# Altium schematic sheet MCU.SchDoc: AVR processor
size A3; Author: Grzegorz Gajoch; DocumentNumber: 9; SheetNumber: 9; SheetTotal: 16; Model: EM1; PageSetup: Record=PageOptions|CenterHorizontal=True|CenterVertical=True|PrintScale=0.52|XCorrection=1.00|YCorrection=1.00|PrintKind=1|BorderSize=5000000|LeftOffset=0|BottomOffset=0|Orientation=2|PaperLength=4200|PaperWidth=2970|Scale=100|PaperSource=7|PrintQuality=600|MediaType=1|DitherType=10|PaperKind=A3|PrintScaleMode=1
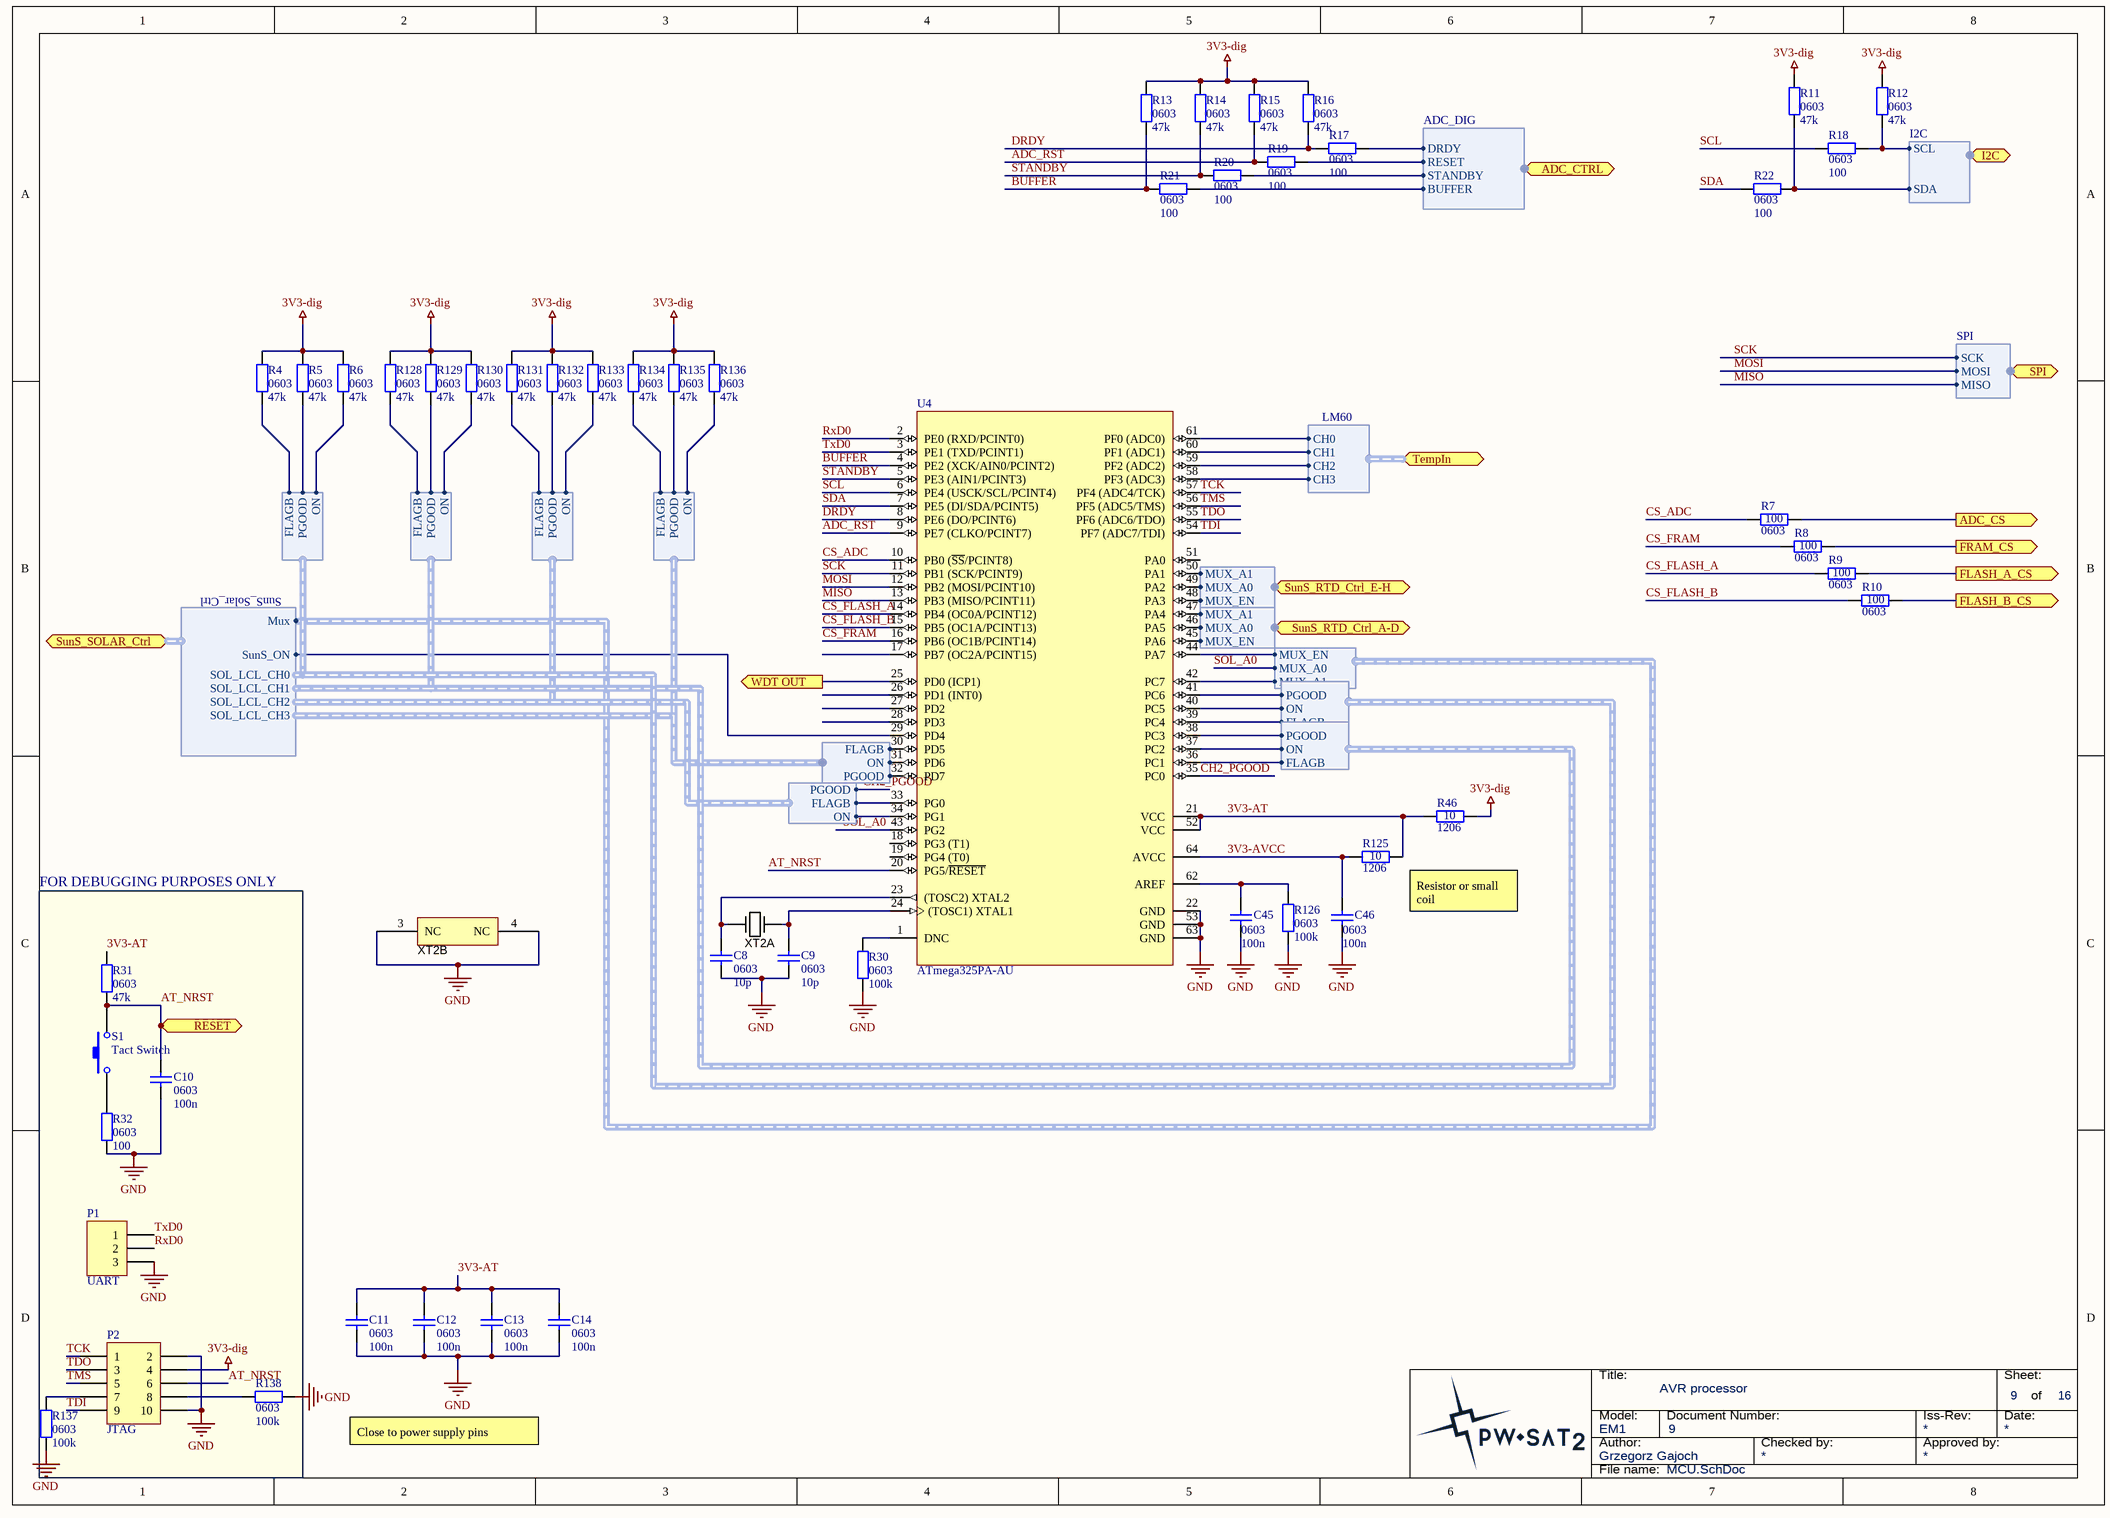
[diagram p0: MCU.SchDoc]

## Parts
C8  0603  value 10p  [SMD_Capacitor_0603]
C9  0603  value 10p  [SMD_Capacitor_0603]
C10  0603  value 100n  [SMD_Capacitor_0603]
C11  0603  value 100n  [SMD_Capacitor_0603]
C12  0603  value 100n  [SMD_Capacitor_0603]
C13  0603  value 100n  [SMD_Capacitor_0603]
C14  0603  value 100n  [SMD_Capacitor_0603]
C45  0603  value 100n  [SMD_Capacitor_0603]
C46  0603  value 100n  [SMD_Capacitor_0603]
P1  UART  [HDR1X3]
P2  JTAG  [HDR2X5]
R4  0603  value 47k  [SMD_Resistor_0603]
R5  0603  value 47k  [SMD_Resistor_0603]
R6  0603  value 47k  [SMD_Resistor_0603]
R7  0603  value 100  [SMD_Resistor_0603]
R8  0603  value 100  [SMD_Resistor_0603]
R9  0603  value 100  [SMD_Resistor_0603]
R10  0603  value 100  [SMD_Resistor_0603]
R11  0603  value 47k  [SMD_Resistor_0603]
R12  0603  value 47k  [SMD_Resistor_0603]
R13  0603  value 47k  [SMD_Resistor_0603]
R14  0603  value 47k  [SMD_Resistor_0603]
R15  0603  value 47k  [SMD_Resistor_0603]
R16  0603  value 47k  [SMD_Resistor_0603]
R17  0603  value 100  [SMD_Resistor_0603]
R18  0603  value 100  [SMD_Resistor_0603]
R19  0603  value 100  [SMD_Resistor_0603]
R20  0603  value 100  [SMD_Resistor_0603]
R21  0603  value 100  [SMD_Resistor_0603]
R22  0603  value 100  [SMD_Resistor_0603]
R30  0603  value 100k  [SMD_Resistor_0603]
R31  0603  value 47k  [SMD_Resistor_0603]
R32  0603  value 100  [SMD_Resistor_0603]
R46  1206  value 10  [SMD_Resistor_1206]
R125  1206  value 10  [SMD_Resistor_1206]
R126  0603  value 100k  [SMD_Resistor_0603]
R128  0603  value 47k  [SMD_Resistor_0603]
R129  0603  value 47k  [SMD_Resistor_0603]
R130  0603  value 47k  [SMD_Resistor_0603]
R131  0603  value 47k  [SMD_Resistor_0603]
R132  0603  value 47k  [SMD_Resistor_0603]
R133  0603  value 47k  [SMD_Resistor_0603]
R134  0603  value 47k  [SMD_Resistor_0603]
R135  0603  value 47k  [SMD_Resistor_0603]
R136  0603  value 47k  [SMD_Resistor_0603]
R137  0603  value 100k  [SMD_Resistor_0603]
R138  0603  value 100k  [SMD_Resistor_0603]
S1  Tact Switch  [Tact Switch 3x6]
U4  ATmega325PA-AU  [64A_N]
XT2  (no value)  [SMD, 5mm x 3.2mm]  (parts A,B of 2)

## Blocks framed on the sheet
FOR DEBUGGING PURPOSES ONLY: C10 P1 P2 R31 R32 R137 R138 S1

## Ports
ADC_CS (out), ADC_CTRL (harness ADC_DIG), FLASH_A_CS (out), FLASH_B_CS (out), FRAM_CS (out), I2C (harness I2C), RESET (in), SPI (harness SPI), SunS_RTD_Ctrl_A-D (harness MUX_Control), SunS_RTD_Ctrl_E-H (harness MUX_Control), SunS_SOLAR_Ctrl (harness SunS_Solar_Ctrl), TempIn (harness LM60), WDT OUT (out)

## Harnesses
MUX_Control: MUX_A0, MUX_A1, MUX_EN
I2C: SCL, SDA
SPI: MOSI, MISO, SCK
ADC_DIG: DRDY, RESET, STANDBY, BUFFER
SunS_Solar_Ctrl: Mux, SunS_ON, SOL_LCL_CH0, SOL_LCL_CH1, SOL_LCL_CH2, SOL_LCL_CH3
LCL_StatCtrl: FLAGB, PGOOD, ON
LM60: CH0, CH1, CH2, CH3

## Nets
3V3-dig: P2.4 R4.2 R5.2 R6.2 R11.2 R12.2 R13.2 R14.2 R15.2 R16.2 R46.1 R128.2 R129.2 R130.2 R131.2 R132.2 R133.2 R134.2 R135.2 R136.2
GND: C8.1 C9.1 C10.1 C11.1 C12.1 C13.1 C14.1 C45.1 C46.1 P1.3 P2.2 P2.10 R30.1 R32.2 R126.1 R137.1 R138.1 U4.22(GND) U4.53(GND) U4.63(GND) XT2.3(NC) XT2.4(NC)
3V3-AT: C11.2 C12.2 C13.2 C14.2 R31.2 R46.2 R125.2 U4.21(VCC) U4.52(VCC)
3V3-AVCC: C46.2 R125.1 U4.64(AVCC)
ADC_CS: R7.1 ; port ADC_CS
ADC_RST: R15.1 R19.1 U4.9(PE7_(CLKO/PCINT7))
AT_NRST: C10.2 P2.6 R31.1 S1.2 U4.20(PG5/~{RESET}) ; port RESET
BUFFER: R13.1 R21.1 U4.4(PE2_(XCK/AIN0/PCINT2))
CH2_PGOOD: R132.1 U4.35(PC0) ; harness LCL_StatCtrl.PGOOD
CS_ADC: R7.2 U4.10(PB0_(~{SS}/PCINT8))
CS_FLASH_A: R9.2 U4.14(PB4_(OC0A/PCINT12))
CS_FLASH_B: R10.2 U4.15(PB5_(OC1A/PCINT13))
CS_FRAM: R8.2 U4.16(PB6_(OC1B/PCINT14))
DRDY: R16.1 R17.1 U4.8(PE6_(DO/PCINT6))
FLASH_A_CS: R9.1 ; port FLASH_A_CS
FLASH_B_CS: R10.1 ; port FLASH_B_CS
FRAM_CS: R8.1 ; port FRAM_CS
MISO: U4.13(PB3_(MISO/PCINT11)) ; port SPI.MISO
MOSI: U4.12(PB2_(MOSI/PCINT10)) ; port SPI.MOSI
RxD0: P1.2 U4.2(PE0_(RXD/PCINT0))
SCK: U4.11(PB1_(SCK/PCINT9)) ; port SPI.SCK
SCL: R18.1 U4.6(PE4_(USCK/SCL/PCINT4))
SDA: R22.1 U4.7(PE5_(DI/SDA/PCINT5))
SOL_A0: U4.43(PG2) ; harness MUX_Control.MUX_A0
STANDBY: R14.1 R20.1 U4.5(PE3_(AIN1/PCINT3))
TCK: P2.1 U4.57(PF4_(ADC4/TCK))
TDI: P2.9 U4.54(PF7_(ADC7/TDI))
TDO: P2.3 U4.55(PF6_(ADC6/TDO))
TMS: P2.5 U4.56(PF5_(ADC5/TMS))
TxD0: P1.1 U4.3(PE1_(TXD/PCINT1))
WDT OUT: U4.25(PD0_(ICP1)) ; port WDT OUT
NetC8_2: C8.2 U4.23((TOSC2)_XTAL2) XT2.1(IN)
NetC9_2: C9.2 U4.24((TOSC1)_XTAL1) XT2.2(OUT)
NetC45_2: C45.2 R126.2 U4.62(AREF)
NetP2_7: P2.7 R137.2
NetP2_8: P2.8 R138.2
NetR4_1: R4.1 U4.39(PC4) ; harness LCL_StatCtrl.FLAGB
NetR5_1: R5.1 U4.41(PC6) ; harness LCL_StatCtrl.PGOOD
NetR6_1: R6.1 U4.40(PC5) ; harness LCL_StatCtrl.ON
NetR11_1: R11.1 R22.2 ; port I2C.SDA
NetR12_1: R12.1 R18.2 ; port I2C.SCL
NetR17_2: R17.2 ; port ADC_CTRL.DRDY
NetR19_2: R19.2 ; port ADC_CTRL.RESET
NetR20_2: R20.2 ; port ADC_CTRL.STANDBY
NetR21_2: R21.2 ; port ADC_CTRL.BUFFER
NetR30_2: R30.2 U4.1(DNC)
NetR32_1: R32.1 S1.1
NetR128_1: R128.1 U4.36(PC1) ; harness LCL_StatCtrl.FLAGB
NetR129_1: R129.1 U4.38(PC3) ; harness LCL_StatCtrl.PGOOD
NetR130_1: R130.1 U4.37(PC2) ; harness LCL_StatCtrl.ON
NetR131_1: R131.1 U4.33(PG0) ; harness LCL_StatCtrl.FLAGB
NetR133_1: R133.1 U4.34(PG1) ; harness LCL_StatCtrl.ON
NetR134_1: R134.1 U4.30(PD5) ; harness LCL_StatCtrl.FLAGB
NetR135_1: R135.1 U4.32(PD7) ; harness LCL_StatCtrl.PGOOD
NetR136_1: R136.1 U4.31(PD6) ; harness LCL_StatCtrl.ON
NetU4_29: U4.29(PD4) ; port SunS_SOLAR_Ctrl.SunS_ON
NetU4_42: U4.42(PC7) ; harness MUX_Control.MUX_A1
NetU4_44: U4.44(PA7) ; harness MUX_Control.MUX_EN
NetU4_45: U4.45(PA6) ; port SunS_RTD_Ctrl_A-D.MUX_EN
NetU4_46: U4.46(PA5) ; port SunS_RTD_Ctrl_A-D.MUX_A0
NetU4_47: U4.47(PA4) ; port SunS_RTD_Ctrl_A-D.MUX_A1
NetU4_48: U4.48(PA3) ; port SunS_RTD_Ctrl_E-H.MUX_EN
NetU4_49: U4.49(PA2) ; port SunS_RTD_Ctrl_E-H.MUX_A0
NetU4_50: U4.50(PA1) ; port SunS_RTD_Ctrl_E-H.MUX_A1
NetU4_58: U4.58(PF3_(ADC3)) ; port TempIn.CH3
NetU4_59: U4.59(PF2_(ADC2)) ; port TempIn.CH2
NetU4_60: U4.60(PF1_(ADC1)) ; port TempIn.CH1
NetU4_61: U4.61(PF0_(ADC0)) ; port TempIn.CH0

Not connected (* = marked no-connect by the designer): U4 17(PB7_(OC2A/PCINT15)) 18(PG3_(T1)) 19(PG4_(T0)) 26(PD1_(INT0)) 27(PD2) 28(PD3) 51(PA0)

## Notes on the sheet
- (near R125) Resistor or small coil
- Close to power supply pins
- Title:
- Sheet:
- of
- Author:
- Model:
- Document Number:
- Checked by:
- Iss-Rev:
- Approved by:
- Date:
- File name:

## Library data of the parts
C8 C9 = Cap1: Capacitor; Published: 8-Jun-2000; LatestRevisionDate: 17-Jul-2002; LatestRevisionNote: Re-released for DXP Platform.; PackageReference: RAD-0.3; Publisher: Altium Limited; PackageDescription: Radial Cap, Thru-Hole; 2 Leads; 0.3 in Pin Spacing
C10-C14 C45 C46 = Cap: Capacitor; Published: 8-Jun-2000; LatestRevisionDate: 17-Jul-2002; LatestRevisionNote: Re-released for DXP Platform.; PackageReference: RAD-0.3; Publisher: Altium Limited; PackageDescription: Radial Cap, Thru-Hole; 2 Leads; 0.3 in Pin Spacing
P1 = Header 3: Header, 3-Pin; LatestRevisionDate: 17-Jul-2002; LatestRevisionNote: Re-released for DXP Platform.; Publisher: Altium Limited
P2 = Header 5X2: Header, 5-Pin, Dual row; LatestRevisionDate: 17-Jul-2002; LatestRevisionNote: Re-released for DXP Platform.; Publisher: Altium Limited
R4-R22 R30-R32 R46 R125 R126 R128-R138 = Res2: Resistor; Published: 8-Jun-2000; LatestRevisionDate: 17-Jul-2002; LatestRevisionNote: Re-released for DXP Platform.; PackageReference: AXIAL-0.4; Publisher: Altium Limited; PackageDescription: Axial Device, Thru-Hole; 2 Leads; 0.4 in Pin Spacing
S1 = TactSwitch: Supplier 1: Farnell
U4 = ATmega325PA-AU: 8-bit AVR Microcontroller, 1.5-5.5V, 32KB Flash, 1KB EEPROM, 2KB SRAM, 64-pin TQFP, Industrial Grade (-40°C to 85°C); DatasheetVersion: revD, Jun-2011; PackageVersion: revC, Oct-2010; PackageReference: 64A; PackageDescription: 64-Pin Plastic Thin Profile Quad Flat Pack, 14 x 14 x 1.0 mm Body, 0.8 mm Pitch (TQFP); Code_JEDEC: MS-026-AEB; ComponentLink1Description: Manufacturer URL; ComponentLink1URL: http://www.atmel.com/; ComponentLink2Description: ATmega165A/PA/325A/PA/3250A/PA/645A/P/6450A/P Datasheet; ComponentLink2URL: http://www.atmel.com/dyn/resources/prod_documents/doc8285.pdf; ComponentLink3Description: ATmega165A/PA/325A/PA/3250A/PA/645A/P/6450A/P Summary; ComponentLink3URL: http://www.atmel.com/dyn/resources/prod_documents/8285S.pdf
XT2 = Crystal_SMD: Resonator Ceramic; Manufacturer 1: Citizen Finetech Miyota; Manufacturer Part Number 1: CMR309T-6.000MABJ-UT; Ratings: 6.00 MHz; Frequency: 6MHz; Frequency Stability: ±50ppm; Frequency Tolerance: ±30ppm; Load Capacitance: 18pF; Operating Mode: Fundamental; SCDType: spec; Package / Case: Cylindrical Can, Radial; Type: MHz Crystal; Operating Temperature: -10°C ~ 60°C; Mounting Type: Surface Mount; Size / Dimension: 0.118" Dia x 0.346" L (3.00mm x 8.80mm); Height: 0.122" (3.10mm); Supplier 1: Digi-Key; Supplier Part Number 1: 300-8348-1-ND; Tolerance: ±50ppm; ComponentLink1URL: http://media.digikey.com/pdf/Data%20Sheets/Citizen%20PDFs/CMR310T%20CMR309T.pdf; ComponentLink1Description: http://media.digikey.com/pdf/Data%20Sheets/Citizen%20PDFs/CMR310T%20CMR309T.pdf